# Altium schematic sheet Connectors.SchDoc: Connectors
size Letter; SheetNumber: 5; SheetTotal: 11
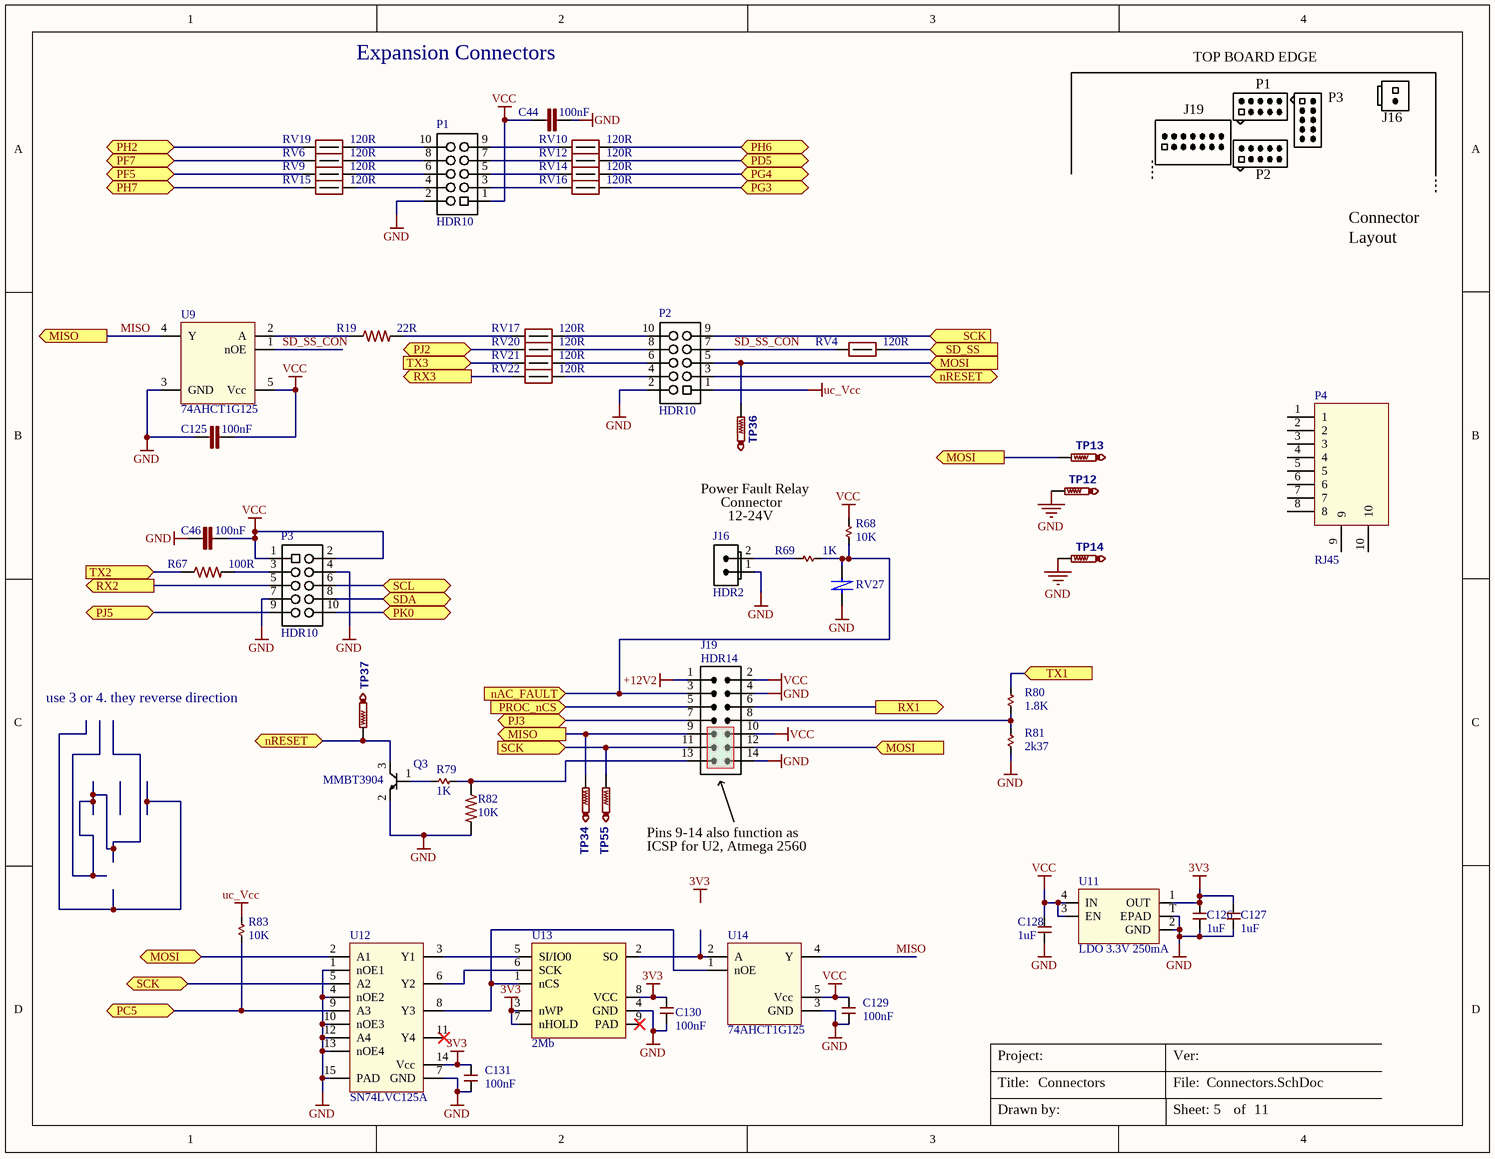
[diagram p0: Connectors.SchDoc]

## Parts
C44  100nF  [C0402]
C46  100nF  [C0402]
C125  100nF  [C0402]
C126  1uF  [C0402]
C127  1uF  [C0402]
C128  1uF  [C0402]
C129  100nF  [C0402]
C130  100nF  [C0402]
C131  100nF  [C0402]
J16  value HDR2  [70543-02]  (hidden comment: CONN 2PIN VERT 0.1" SHRD LOCKING)
J19  HDR14  [HDR2x7_SMT_BOT_ENTRY]
P1  HDR10  [HDR2X5 IDC]
P2  HDR10  [HDR2X5 IDC]
P3  HDR10  [HDR2X5 IDC THIEVING]
P4  RJ45  [RJ45 SMT]
Q3  MMBT3904  [SOT523 SMALL]
R19  22R  [R0402]
R67  100R  [R0402]
R68  10K  [R0402]
R69  1K  [R0402]
R79  1K  [R0402]
R80  1.8K  [R0402]
R81  2k37  [R0402]
R82  10K  [R0402]
R83  10K  [R0402]
RV4  120R  [R0402]
RV6  120R  [R0402]
RV9  120R  [R0402]
RV10  120R  [R0402]
RV12  120R  [R0402]
RV14  120R  [R0402]
RV15  120R  [R0402]
RV16  120R  [R0402]
RV17  120R  [R0402]
RV19  120R  [R0402]
RV20  120R  [R0402]
RV21  120R  [R0402]
RV22  120R  [R0402]
RV27  VRS0402SR55R101N  [C0402]  (value not drawn)
TP12  TestPoint  [TP1-27]  (value not drawn)  (no BOM)
TP13  TestPoint  [TP1-27]  (value not drawn)  (no BOM)
TP14  TestPoint  [TP1-27]  (value not drawn)  (no BOM)
TP34  TestPoint  [TP1-27]  (value not drawn)  (no BOM)
TP36  TestPoint  [TP1-27]  (value not drawn)  (no BOM)
TP37  TestPoint  [TP1-27]  (value not drawn)  (no BOM)
TP55  TestPoint  [TP1-27]  (value not drawn)  (no BOM)
U9  74AHCT1G125  [SOTFL50P160X60-5L]
U11  LDO 3.3V 250mA  [XDFN4 1X1]
U12  SN74LVC125A  [PVQFN14_3.5X3.5]
U13  2Mb  [USON8 2X3]
U14  74AHCT1G125  [SOTFL50P160X60-5L]

## Ports
MISO, MOSI, nAC_FAULT, nRESET, PC5, PD5, PF5, PF7, PG3, PG4, PH2, PH6, PH7, PJ2, PJ3, PJ5, PK0, PROC_nCS, RX1, RX2, RX3, SCK, SCL, SD_SS, SDA, TX1, TX2, TX3

## Nets
3V3: C126.2 C127.2 C130.2 C131.1 U11.1(OUT) U12.14(Vcc) U13.3(nWP) U13.7(nHOLD) U13.8(VCC)
+12V2: J19.1(S)
GND: C44.2 C46.1 C125.1 C126.1 C127.1 C128.1 C129.1 C130.1 C131.2 J16.1(S) J19.4(S) J19.14(S) P1.2 P2.2 P3.4 P3.7 Q3.2(E) R81.2 R82.2 RV27.1 TP12.TP TP14.TP U9.3(GND) U11.2(GND) U11.T(EPAD) U12.1(nOE1) U12.4(nOE2) U12.7(GND) U12.10(nOE3) U12.12(A4) U12.13(nOE4) U12.15(PAD) U13.4(GND) U14.3(GND)
uc_Vcc: P2.1 R83.1
VCC: C44.1 C46.2 C125.2 C128.2 C129.2 J19.2(S) J19.10(S) P1.1 P3.1 P3.2 R68.2 U9.5(Vcc) U11.3(EN) U11.4(IN) U14.5(Vcc)
MISO: J19.9(S) TP34.TP U9.4(Y) U14.4(Y) ; port MISO
MOSI: J19.12(S) P2.5 TP13.TP TP36.TP U12.2(A1) ; port MOSI
nAC_FAULT: J19.3(S) R68.1 R69.2 RV27.2 ; port nAC_FAULT
nRESET: P2.3 Q3.3(C) TP37.TP ; port nRESET
PC5: R83.2 U12.9(A3) ; port PC5
PD5: RV12.2 ; port PD5
PF5: RV9.1 ; port PF5
PF7: RV6.1 ; port PF7
PG3: RV16.2 ; port PG3
PG4: RV14.2 ; port PG4
PH2: RV19.1 ; port PH2
PH6: RV10.2 ; port PH6
PH7: RV15.1 ; port PH7
PJ2: RV20.1 ; port PJ2
PJ3: J19.7(S) ; port PJ3
PJ5: P3.9 ; port PJ5
PK0: P3.10 ; port PK0
PROC_nCS: J19.5(S) ; port PROC_nCS
RX1: J19.6(S) ; port RX1
RX2: P3.5 ; port RX2
RX3: RV22.1 ; port RX3
SCK: J19.11(S) P2.9 TP55.TP U12.5(A2) ; port SCK
SCL: P3.6 ; port SCL
SD_SS: RV4.2 ; port SD_SS
SD_SS_CON: P2.7 RV4.1 U9.1(nOE)
SDA: P3.8 ; port SDA
TX1: R80.1 ; port TX1
TX2: R67.1 ; port TX2
TX3: RV21.1 ; port TX3
NetJ16_2: J16.2(S) R69.1
NetJ19_8: J19.8(S) R80.2 R81.1
NetJ19_13: J19.13(S) R79.1 R82.1
NetP1_3: P1.3 RV16.1
NetP1_4: P1.4 RV15.2
NetP1_5: P1.5 RV14.1
NetP1_6: P1.6 RV9.2
NetP1_7: P1.7 RV12.1
NetP1_8: P1.8 RV6.2
NetP1_9: P1.9 RV10.1
NetP1_10: P1.10 RV19.2
NetP2_4: P2.4 RV22.2
NetP2_6: P2.6 RV21.2
NetP2_8: P2.8 RV20.2
NetP2_10: P2.10 RV17.2
NetP3_3: P3.3 R67.2
NetQ3_1: Q3.1(B) R79.2
NetR19_1: R19.1 U9.2(A)
NetR19_2: R19.2 RV17.1
NetU12_3: U12.3(Y1) U13.5(SI/IO0)
NetU12_6: U12.6(Y2) U13.6(SCK)
NetU12_8: U12.8(Y3) U13.1(nCS) U14.1(nOE)
NetU13_2: U13.2(SO) U14.2(A)

Not connected (* = marked no-connect by the designer): P4 1 2 3 4 5 6 7 8 9 10; U9 23(NC); U12 11(Y4)* 23(NC); U13 9(PAD)*; U14 23(NC)

## Notes on the sheet
- Expansion Connectors
- TOP BOARD EDGE
- P1
- P3
- J19
- J16
- P2
- Connector
- Layout
- (near R68) Power Fault Relay
- 12-24V
- use 3 or 4. they reverse direction
- Pins 9-14 also function as
- ICSP for U2, Atmega 2560
- Labels drawn without touching a wire or pin: 3V3
- Title:
- Project:
- File:
- Ver:
- Drawn by:
- Sheet:
- of

## Library data of the parts
C44 C46 C125 = GRM155R71C104KA88D: CAP CER 0402 100nF 16V 10% X7R; MANUFACTURER: Murata; PART DESCRIPTION: 0.10µF ±10% 16V Ceramic Capacitor X7R 0402 (1005 Metric); TOLERANCE: +/- 10%; EE_SPEC: 100nF 16V X7R 0402; VALUE: 100nF; MANUFACTURER #: GRM155R71C104KA88D; DISTRIBUTOR #: 490-3261-2-ND; DISTRIBUTOR: Digi-Key; PART: 100nF
C126-C128 = 1uF 0402 6.3V X5R: CAP CER 0402 1uF 6.3V 10% X5R; MANUFACTURER: Murata; MANUFACTURER #: GRM155R60J105KE19D; PART: 1uF 6.3V X5R 0402; PART DESCRIPTION: 1µF ±10% 6.3V Ceramic Capacitor X5R 0402 (1005 Metric); DISTRIBUTOR #: 490-1320-2-ND; DISTRIBUTOR: Digikey; TOLERANCE: 10%; EE_SPEC: 6.3V; VALUE: 1uF
C129-C131 = 100nF 0402 16V X7R: CAP CER 0402 100nF 16V 10% X7R; MANUFACTURER: Murata; MANUFACTURER #: GRM155R71C104KA88D; PART: 0.1uF 16V X7R 0402; PART DESCRIPTION: 0.10µF ±10% 16V Ceramic Capacitor X7R 0402 (1005 Metric); VALUE: 100nF; DISTRIBUTOR #: 490-3261-2-ND; DISTRIBUTOR: Digikey; TOLERANCE: 10%; EE_SPEC: 16V
J16 = CONN 2PIN VERT 0.1" SHRD LOCKING: Connector 2pos; MANUFACTURER: Molex; MANUFACTURER #: 0705430001; PART: 10 Pin Conn; PART DESCRIPTION: 2 Positions Header, Shrouded Connector 0.100" (2.54mm) Through Hole Gold; TOLERANCE: -NA-; DISTRIBUTOR #: WM4800-ND; DISTRIBUTOR: Digi-Key; EE_SPEC: -NA-
J19 = CONN 14PIN 0.1" FEMALE 2-ROW SMT BOT-ENTRY: CONN RCPT DUAL ENTRY 14POS .100"; MANUFACTURER: TE Connectivity; MANUFACTURER #: 969973-7; PART DESCRIPTION: 14 Position Receptacle, Bottom or Top Entry Connector Gold 0.100" (2.54mm) Surface Mount; TOLERANCE: -NA-; DISTRIBUTOR #: A107060CT-ND; DISTRIBUTOR: Digikey; PART: HDR14; EE_SPEC: -NA-; VALUE: HDR14
P1-P3 = Header 10PIN 2ROW T-HOLE VERT SHROUDED: CONN HEADER VERT 10POS GOLD; MANUFACTURER #: 302-S101; MANUFACTURER: On Shore; PART DESCRIPTION: 10 Positions Header Connector 0.100" (2.54mm) Through Hole Gold; TOLERANCE: -NA-; DISTRIBUTOR #: ED1543-ND; DISTRIBUTOR: Digikey; PART: HDR10; VALUE: HDR10; EE_SPEC: -NA-
P4 = RJ45 SMT: RJCSE538001
Q3 = MMBT3904_SOT523: TRANS NPN 60V 0.2A SOT523; MANUFACTURER #: MMBT3904T-7-F; MANUFACTURER: Diodes Incorporated; PART: TRANS NPN 40V 0.2A SOT523; PART DESCRIPTION: Bipolar (BJT) Transistor NPN 40V 200mA 300MHz 150mW Surface Mount SOT-523; TOLERANCE: -NA-; EE_SPEC: 40V 0.2A; DISTRIBUTOR #: MMBT3904T-FDITR-ND; DISTRIBUTOR: Digikey; VALUE: NPN
R19 = RC0402FR-0722RL: RES 0402 22r 62.5mW 1%; Manufacturer: Yageo; Part Description: 22 Ohm ±1% 0.063W, 1/16W Chip Resistor 0402 (1005 Metric) Moisture Resistant Thick Film; EE_SPEC: 22R 1% 0402; Tolerance: +/- 1%; VALUE: 22R; DISTRIBUTOR #: 311-22.0LRTR-ND; DISTRIBUTOR: Digi-Key; MANUFACTURER #: RC0402FR-0722RL; PART: 22R
R67 = RES 100R 0402 1%: RES SMD 100 OHM 1% 1/16W 0402; MANUFACTURER: Yageo; MANUFACTURER #: RC0402FR-07100RL; PART: 100R 1% 0402; PART DESCRIPTION: 100 Ohm ±1% 0.063W, 1/16W Chip Resistor 0402 (1005 Metric) Moisture Resistant Thick Film; VALUE: 100R; DISTRIBUTOR #: 311-100LRTR-ND; DISTRIBUTOR: Digi-Key; TOLERANCE: 1%; EE_SPEC: 100R 1% 0402
R68 = 10k 1% 0402: RES SMD 10K OHM 1% 1/16W 0402; MANUFACTURER: Yageo; MANUFACTURER #: RC0402FR-0710KP; PART DESCRIPTION: 10k Ohm ±1% 0.063W, 1/16W Chip Resistor 0402 (1005 Metric) Moisture Resistant Thick Film; EE_SPEC: 10k 1% 0402 1/16W; DISTRIBUTOR #: YAG1249TR-ND; DISTRIBUTOR: Digi-key; PART: 10k 1% 0402; TOLERANCE: 1%; VALUE: 10K
R69 R79 = RC0402FR-071KL: RES SMD 1K OHM 1% 1/16W 0402; Manufacturer: Yageo; Part Description: 1k Ohm ±1% 0.063W, 1/16W Chip Resistor 0402 (1005 Metric) Moisture Resistant Thick Film; EE_SPEC: 1k 1% 0402; Tolerance: +/- 1%; VALUE: 1K; MANUFACTURER #: RC0402FR-071KL; DISTRIBUTOR #: 311-1.00KLRTR-ND; DISTRIBUTOR: Digi-Key; PART: 1k
R80 = RC0402FR-071K8L: RES SMD 1.8K OHM 1% 1/16W 0402; Manufacturer: Yageo; Part Description: 1.8k Ohm ±1% 0.063W, 1/16W Chip Resistor 0402 (1005 Metric) Moisture Resistant Thick Film; EE_SPEC: 1.8k 1% 0402; Tolerance: +/- 1%; VALUE: 1.8K; MANUFACTURER #: RC0402FR-071K8L; DISTRIBUTOR #: 311-1.80KLRTR-ND; DISTRIBUTOR: Digi-Key; PART: 1.8k
R81 = RC0402FR-072K37L: RES SMD 2.37K OHM 1% 1/16W 0402; Manufacturer: Yageo; Part Description: 2.37k Ohm ±1% 0.063W, 1/16W Chip Resistor 0402 (1005 Metric) Moisture Resistant Thick Film; EE_SPEC: 2.37k 1% 0402; Tolerance: +/- 1%; VALUE: 2k37; MANUFACTURER #: RC0402FR-072K37L; DISTRIBUTOR #: 311-2.37KLRTR-ND; DISTRIBUTOR: Digi-Key; PART: 2.37k
R82 = RC0402FR-0710KP: RES SMD 10K OHM 1% 1/16W 0402; MANUFACTURER: Yageo; PART: 10k 1% 0402; PART DESCRIPTION: 10k Ohm ±1% 0.063W, 1/16W Chip Resistor 0402 (1005 Metric) Moisture Resistant Thick Film; EE_SPEC: 10k 1% 0402 1/16W; VALUE: 10K; MANUFACTURER #: RC0402FR-0710KP; DISTRIBUTOR #: YAG1249TR-ND; DISTRIBUTOR: Digi-Key; TOLERANCE: 1%
R83 = 10k 1% 0402: RES SMD 10K OHM 1% 1/16W 0402; MANUFACTURER: Yageo; MANUFACTURER #: RC0402FR-0710KP; PART DESCRIPTION: 10k Ohm ±1% 0.063W, 1/16W Chip Resistor 0402 (1005 Metric) Moisture Resistant Thick Film; DISTRIBUTOR #: YAG1249TR-ND; DISTRIBUTOR: Digikey; PART: 10k 1% 0402; TOLERANCE: 1%; EE_SPEC: 1/16W; VALUE: 10K
RV4 RV6 RV9 RV10 RV12 RV14-RV17 RV19-RV22 = FERRITE 120R 1A 0402: FERRITE BEAD 120 OHM 0402 1LN; MANUFACTURER: Taiyo Yuden; MANUFACTURER #: BKP1005HS121-T; VALUE: 120Rfb; TOLERANCE: -NA-; EE_SPEC: 1A; DISTRIBUTOR #: 587-1921-2-ND; DISTRIBUTOR: Digikey; PART: FERRITE 120R 1A 0402; PART DESCRIPTION: FERRITE BEAD 120 OHM 0402 1LN
RV27 = VRS0402SR55R101N: Multi-Layer Varistor; Manufacturer: Yageo; Part Description: VARISTOR 12V 10A 0402; Value: 12V; EE_SPEC: 5.5Vdc 12Vvar 60pF; Tolerance: NA; DISTRIBUTOR #: 311-1516-2-ND; DISTRIBUTOR: Digi-Key; MANUFACTURER #: VRS0402SR55R101N; PART: 12V
TP12-TP14 TP34 TP36 TP37 TP55 = TestPoint: Test Point
U9 U14 = SN74AHCT1G125DRLR: IC BUS BUFF TRI-ST N-INV  SOT-553; MANUFACTURER: TI; PART DESCRIPTION: Buffer, Non-Inverting 1 Element 1 Bit per Element Push-Pull Output SOT-5; TOLERANCE: -NA-; EE_SPEC: 4.5-5.5V; MANUFACTURER #: SN74AHCT1G125DRLR; DISTRIBUTOR #: 296-19379-2-ND; DISTRIBUTOR: Digikey; PART: SN74AHCT1G125DRLR; VALUE: 74AHCT1G125
U11 = LDO 3.3V 250mA: IC REG LINEAR 3.3V 250MA 4XDFN; MANUFACTURER #: NCP160AMX330TBG; MANUFACTURER: On Semi; PART DESCRIPTION: Linear Voltage Regulator IC Positive Fixed 1 Output 3.3V 250mA 4-XDFN (1x1); TOLERANCE: -NA-; DISTRIBUTOR #: NCP160AMX330TBGOSTR-ND; DISTRIBUTOR: Digikey; PART: IC REG LINEAR 3.3V 250MA 4XDFN; VALUE: LDO 3.3V 250mA; EE_SPEC: 250mA
U12 = SN74LVC125A: IC BUS BUFF TRI-ST QD 14VQFN; MANUFACTURER #: SN74LVC125ARGYR; MANUFACTURER: TI; PART DESCRIPTION: Buffer, Non-Inverting 4 Element 1 Bit per Element Push-Pull Output 14-VQFN (3.5x3.5); TOLERANCE: -NA-; EE_SPEC: 1.65-3.6Vcc, 5V tolerant inputs; DISTRIBUTOR #: 296-13961-2-ND; DISTRIBUTOR: Digikey; PART: IC BUS BUFF TRI-ST QD 14VQFN; VALUE: SN74LVC125A
U13 = W25X20CL: IC FLASH 2MBIT 104MHZ 8USON; MANUFACTURER #: W25X20CLUXIG TR; MANUFACTURER: Winbond; PART DESCRIPTION: FLASH Memory IC 2Mb (256K x 8) SPI 104MHz 8-USON (2x3); TOLERANCE: -NA-; EE_SPEC: 3.3V; DISTRIBUTOR #: W25X20CLUXIGTR-ND; DISTRIBUTOR: Digikey; PART: IC FLASH 2MBIT 104MHZ 8USON; VALUE: 2Mb